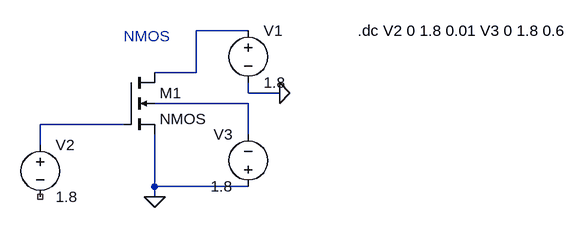
[diagram p0: schematic NMOS_VSB.asc]
NMOS_VSB.asc, the LTspice schematic file:
Version 4
SHEET 1 880 680
WIRE 336 16 256 16
WIRE 256 80 256 16
WIRE 256 80 192 80
WIRE 336 112 336 96
WIRE 384 112 336 112
WIRE 336 128 192 128
WIRE 144 160 16 160
WIRE 336 176 336 128
WIRE 16 192 16 160
WIRE 192 256 192 176
WIRE 336 256 192 256
WIRE 192 272 192 256
FLAG 192 272 0
FLAG 384 112 0
SYMBOL nmos4 144 80 R0
SYMATTR InstName M1
SYMATTR Value2 l=180n w=500n
SYMBOL voltage 336 0 R0
WINDOW 123 0 0 Left 0
WINDOW 39 0 0 Left 0
SYMATTR InstName V1
SYMATTR Value 1.8
SYMBOL voltage 16 176 R0
WINDOW 123 0 0 Left 0
WINDOW 39 0 0 Left 0
SYMATTR InstName V2
SYMATTR Value 1.8
SYMBOL voltage 336 272 R180
WINDOW 0 24 96 Left 2
WINDOW 3 24 16 Left 2
WINDOW 123 0 0 Left 0
WINDOW 39 0 0 Left 0
SYMATTR InstName V3
SYMATTR Value 1.8
TEXT 144 24 Left 2 ;NMOS
TEXT 504 16 Left 2 !.dc V2 0 1.8 0.01 V3 0 1.8 0.6

The netlist it stands for:
* NMOS_VSB.asc
M1 N001 N003 0 N002 NMOS l=180n w=500n
V1 N001 0 1.8
V2 N003 NC_01 1.8
V3 0 N002 1.8
.model NMOS NMOS
.model PMOS PMOS
.lib standard.mos
* NMOS
.dc V2 0 1.8 0.01 V3 0 1.8 0.6
.backanno
.end